# EAGLE design final-schematic_Alternate_Placement (EAGLE 8.4.0)
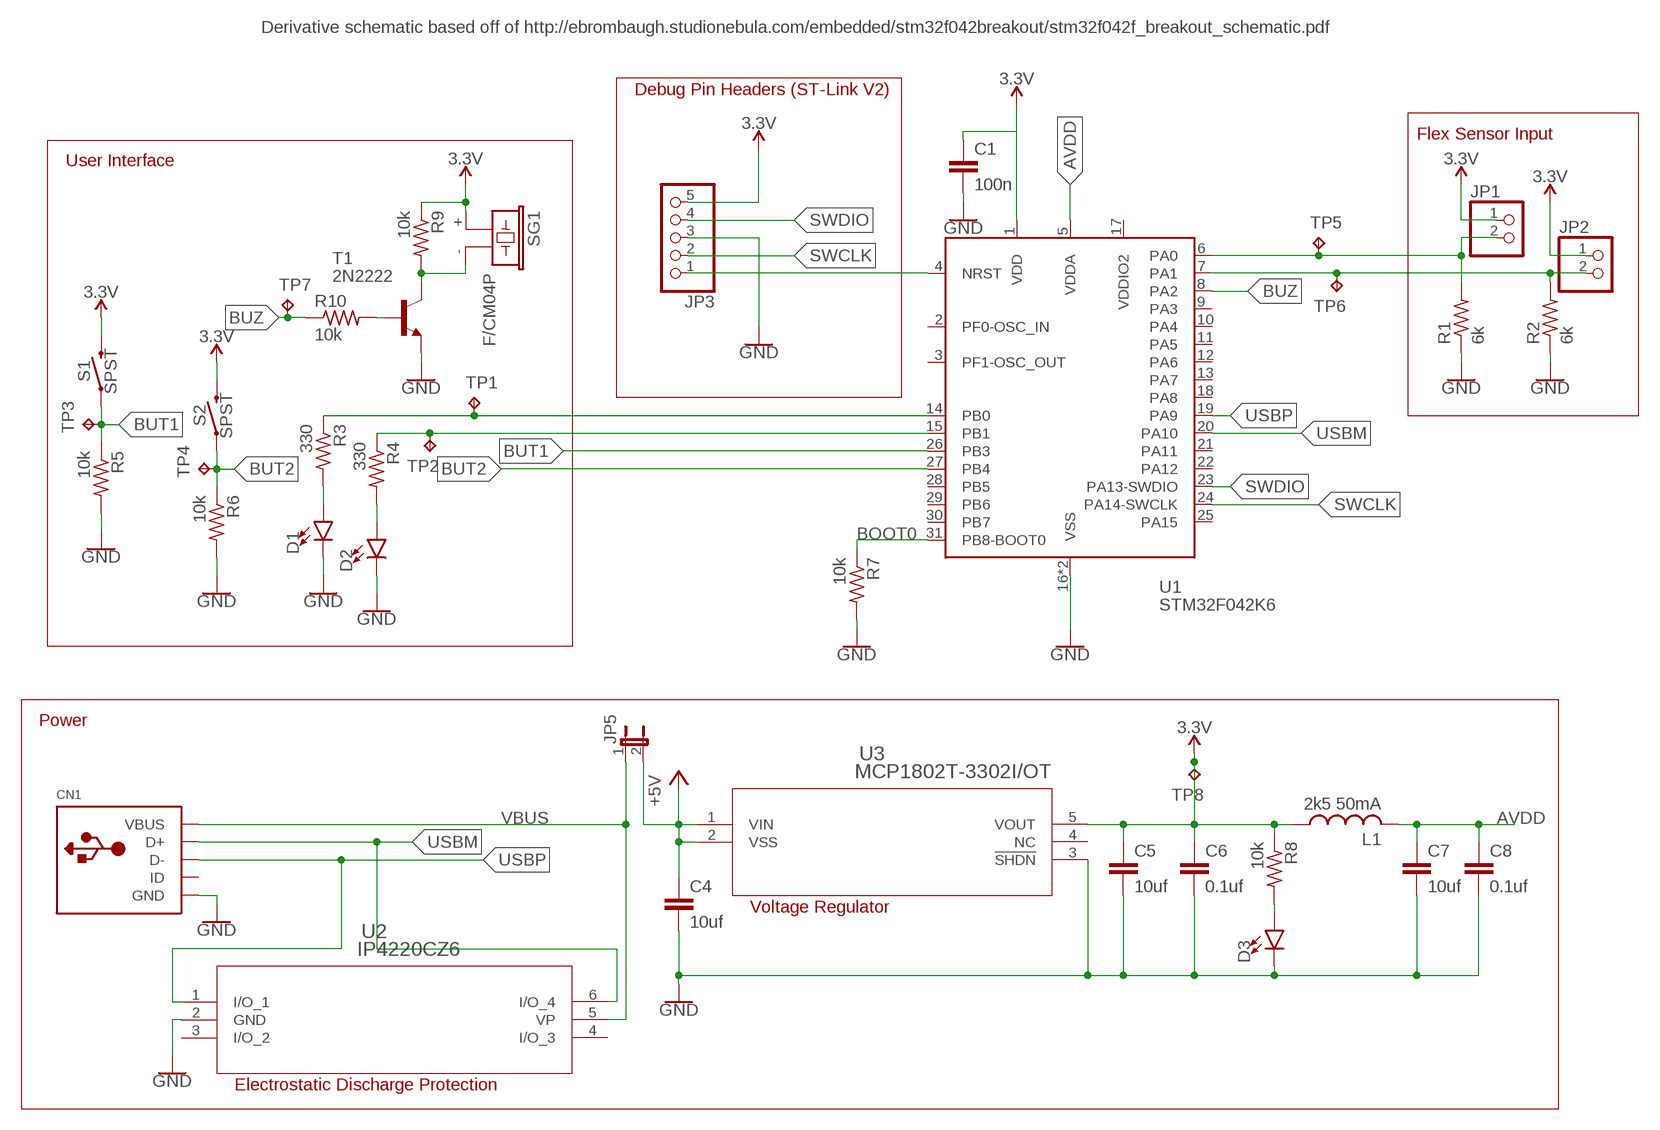
[diagram p0: schematic, sheet 1]

## Parts
C1  100n  C-EUC0805  [C0805]
C4  10uf  C-EUC0805  [C0805]
C5  10uf  C-EUC0805  [C0805]
C6  0.1uf  C-EUC0805  [C0805]
C7  10uf  C-EUC0805  [C0805]
C8  0.1uf  C-EUC0805  [C0805]
CN1  USBMOLEX  [USB-MINIB-THM-MOLEX]
D1  LED10MM  [LED_10MM]
D2  LED10MM  [LED_10MM]
D3  LED10MM  [LED_10MM]
JP1  PINHD-1X2  [1X02]
JP2  PINHD-1X2  [1X02]
JP3  PINHD-1X5  [1X05]
JP5  JP1E  [JP1]
L1  2k5 50mA  L-USL3216C  [L3216C]
R1  6k  R-US_R0805  [R0805]
R2  6k  R-US_R0805  [R0805]
R3  330  R-US_R0805  [R0805]
R4  330  R-US_R0805  [R0805]
R5  10k  R-US_R0805  [R0805]
R6  10k  R-US_R0805  [R0805]
R7  10k  R-US_R0805  [R0805]
R8  10k  R-US_R0805  [R0805]
R9  10k  R-US_R0805  [R0805]
R10  10k  R-US_R0805  [R0805]
S1  SPST  MOMENTARY-SWITCH-SPST-PTH-6.0MM  [TACTILE_SWITCH_PTH_6.0MM]
S2  SPST  MOMENTARY-SWITCH-SPST-PTH-6.0MM  [TACTILE_SWITCH_PTH_6.0MM]
SG1  F/CM04P  [F/CM04P]
T1  2N2222  [TO92-EBC-OVAL]
TP1  TPB2,54  [B2,54]
TP2  TPB2,54  [B2,54]
TP3  TPB2,54  [B2,54]
TP4  TPB2,54  [B2,54]
TP5  TPB2,54  [B2,54]
TP6  TPB2,54  [B2,54]
TP7  TPB2,54  [B2,54]
TP8  TPB2,54  [B2,54]
U1  STM32F042K6  [QFP32-7X7]
U2  IP4220CZ6  [SOT457]
U3  MCP1802T-3302I/OT  [SOT-23-5_MC]

## Nets
3.3V: C1.1 C5.1 C6.1 JP1.1 JP2.1 JP3.5 L1.1 R8.1 R9.1 S1.3 S2.3 SG1.+ TP8.TP U1.1(VDD) U3.5(VOUT)
+5V: C4.1 JP5.2 U3.1(VIN) U3.2(VSS)
AVDD: C7.1 C8.1 L1.2 U1.5(VDDA)
BOOT0: R7.1 U1.31(PB8-BOOT0)
BUT1: R5.1 S1.1 TP3.TP U1.26(PB3)
BUT2: R6.1 S2.1 TP4.TP U1.27(PB4)
BUZ: R10.1 TP7.TP U1.8(PA2)
GND: C4.2 C5.2 C6.2 C7.2 C8.2 CN1.GND D1.C D2.C D3.C JP3.3 R1.1 R2.1 R5.2 R6.2 R7.2 T1.E U1.16(VSS) U1.32(VSS) U2.2(GND) U3.3(!SHDN)
N$1: JP1.2 R1.2 TP5.TP U1.6(PA0)
N$2: JP2.2 R2.2 TP6.TP U1.7(PA1)
N$3: R3.1 TP1.TP U1.14(PB0)
N$4: R4.1 TP2.TP U1.15(PB1)
N$5: D1.A R3.2
N$6: D2.A R4.2
N$7: R9.2 SG1.- T1.C
N$8: R10.2 T1.B
N$9: D3.A R8.2
N$11: C1.2 ; supply symbol labelled GND
NRST: JP3.1 U1.4(NRST)
SWCLK: JP3.2 U1.24(PA14-SWCLK)
SWDIO: JP3.4 U1.23(PA13-SWDIO)
USBM: CN1.D+ U1.20(PA10) U2.6(I/O_4)
USBP: CN1.D- U1.19(PA9) U2.1(I/O_1)
VBUS: CN1.VBUS JP5.1 U2.5(VP)
Unconnected: CN1.ID U1.2(PF0-OSC_IN) U1.3(PF1-OSC_OUT) U1.9(PA3) U1.10(PA4) U1.11(PA5) U1.12(PA6) U1.13(PA7) U1.18(PA8) U1.21(PA11) U1.22(PA12) U1.25(PA15) U1.28(PB5) U1.29(PB6) U1.30(PB7) U2.3(I/O_2) U2.4(I/O_3) U3.4(NC)

## Notes on the sheet
- Derivative schematic based off of http://ebrombaugh.studionebula.com/embedded/stm32f042breakout/stm32f042f_breakout_schematic.pdf
- Debug Pin Headers (ST-Link V2)
- Flex Sensor Input
- User Interface
- Power
- Voltage Regulator
- Electrostatic Discharge Protection

## Power pins joined to a net without a drawn wire
VDDIO2: U1.17(VDDIO2)

## Library data of the parts
C1 C4-C8 = rcl:C-EU: CAPACITOR, European symbol
CN1 = adafruit:USB: USB Connectors USBMINIB - Surface Mount Female Mini-B USB Connector 4UConnector: 06564 By microbuilder.eu Thru-hole RA Female Mini-B USB Connector 4UConnector: 18732 By ladyada.net
D1-D3 = SparkFun-LED:LED: LED (Generic) Standard schematic elements and footprints for 5mm, 3mm, 1206, and 0603 sized LEDs. Generic LEDs with no color specified.
JP1 JP2 = pinhead:PINHD-1X2: PIN HEADER
JP3 = pinhead:PINHD-1X5: PIN HEADER
JP5 = jumper:JP1E: JUMPER
L1 = rcl:L-US: INDUCTOR, American symbol
R1-R10 = rcl:R-US_: RESISTOR, American symbol
S1 S2 = SparkFun-Switches:MOMENTARY-SWITCH-SPST: Momentary Switch (Pushbutton) - SPST Normally-open (NO) SPST momentary switches (buttons, pushbuttons). Variants PTH-12MM - 12mm square, through-hole Momentary Pushbutton Switch - 12mm Square <https://www.sparkfun.com/products/9190> (COM-09190) PTH-6.0MM, PTH-6.0MM-KIT - 6.0mm square, through-hole Mini Pushbutton Switch <https://www.sparkfun.com/products/97> (COM-00097) KIT package intended for soldering kit's - only one side of pads' copper is exposed. PTH-RIGHT-ANGLE-KIT - Right-angle, through-hole Right Angle Tactile Button <https://www.sparkfun.com/products/10791> - Used on SparkFun BigTime Watch Kit <https://www.sparkfun.com/products/11734> SMD-12MM - 12mm square, surface-mount Tactile Button - SMD (12mm) <https://www.sparkfun.com/products/12993> (COM-12993) Used on SparkFun PicoBoard <https://www.sparkfun.com/products/11888> SMD-4.5MM - 4.5mm Square Trackball Switch Used on SparkFun Blackberry Trackballer Breakout <https://www.sparkfun.com/products/13169> SMD-4.6MMX2.8MM - 4.60mm x 2.80mm, surface mount Used on SparkFun SAMD21 Mini Breakout <https://www.sparkfun.com/products/13664> SMD-5.2MM, SMD-5.2-REDUNDANT - 5.2mm square, surface-mount Mini Pushbutton Switch - SMD <https://www.sparkfun.com/products/8720> (COM-08720) Used on Arduino Pro Mini <https://www.sparkfun.com/products/11114> REDUNDANT package connects both switch circuits together SMD-6.0X3.5MM - 6.0 x 3.5mm, surface mount Momentary Reset Switch SMD <https://www.sparkfun.com/products/8229> (COM-08229) SMD-6.2MM-TALL - 6.2mm square, surface mount Tactile Button - SMD (6mm) <https://www.sparkfun.com/products/12992> Used on SparkFun Digital Sandbox <https://www.sparkfun.com/products/12651> SMD-RIGHT-ANGLE - Right-angle, surface mount Used on SparkFun Block for Intel® Edison - Arduino <https://www.sparkfun.com/products/13036>; PROD_ID: SWCH-08441; SF_SKU: COM-00097
SG1 = buzzer:F/CM04P: BUZZER Source: Buerklin; OC_FARNELL: unknown; OC_NEWARK: unknown
T1 = adafruit:2N2222: NPN TRANSISTOR Big oval pads
TP1-TP8 = testpad:TP: Test pad
U1 = STM32F042K:STM32F042K6
U2 = IP4220CZ6:IP4220CZ6; MANUFACTURER_PART_NUMBER: IP4220CZ6; VENDOR: NXP
U3 = MCP1802T:MCP1802T-3302I/OT; MANUFACTURER_PART_NUMBER: MCP1802T3302IOT; VENDOR: Microchip

## Board
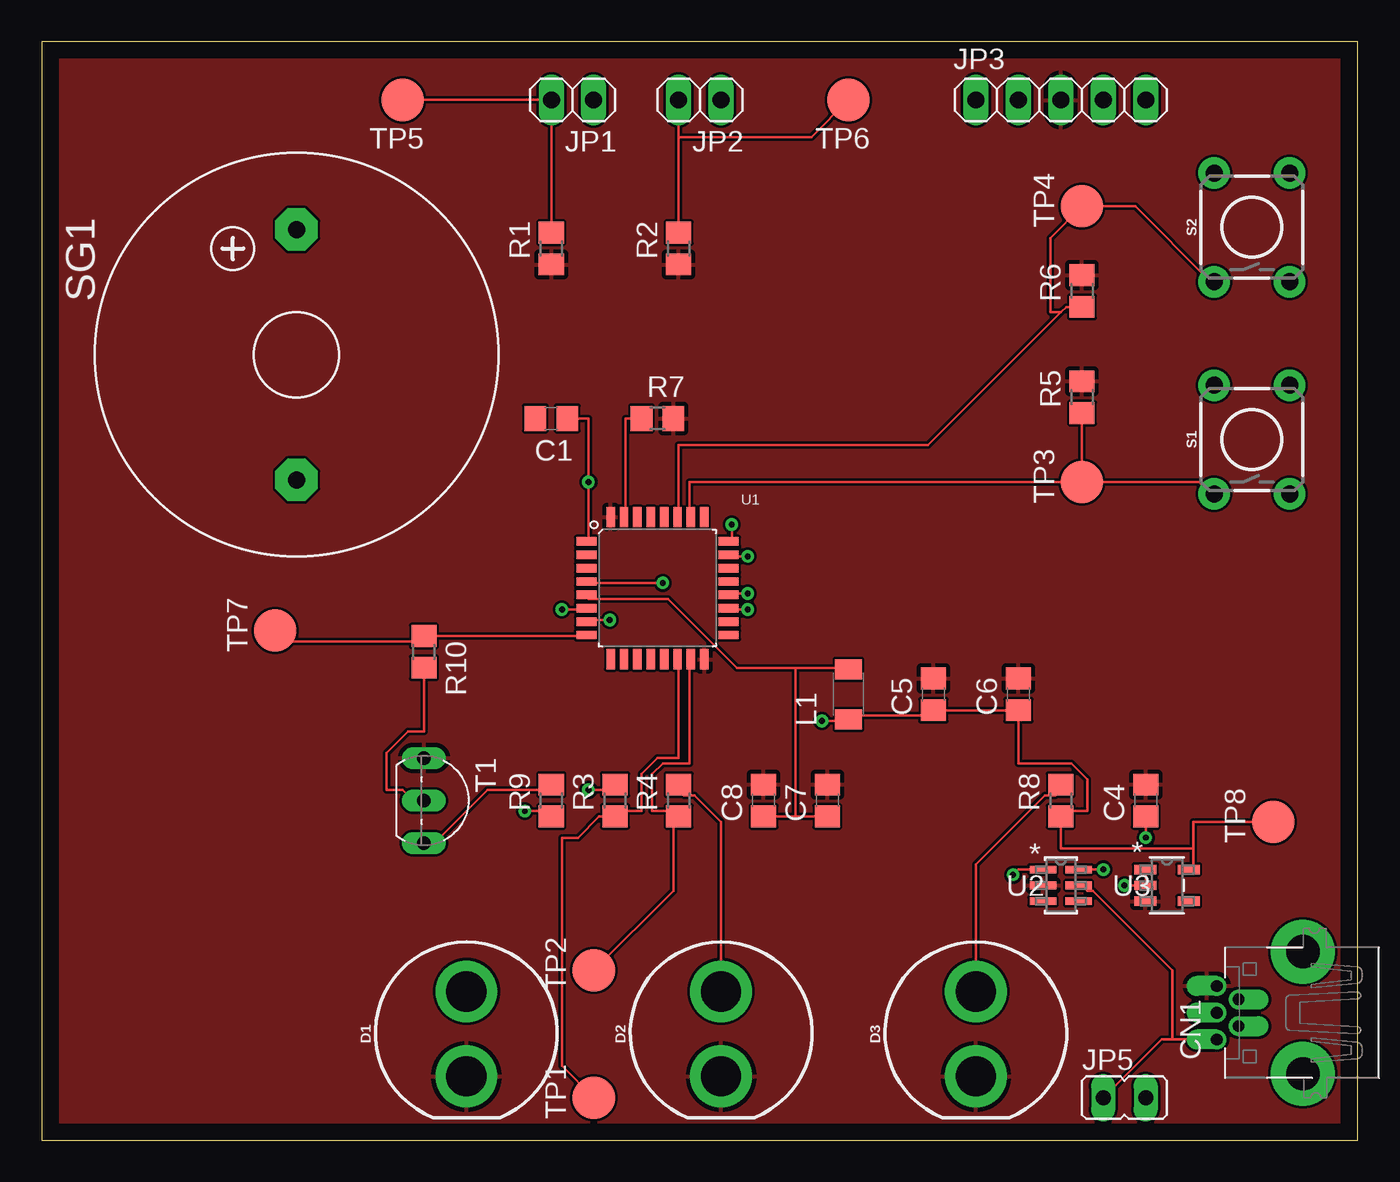
[diagram p1: board, top side]
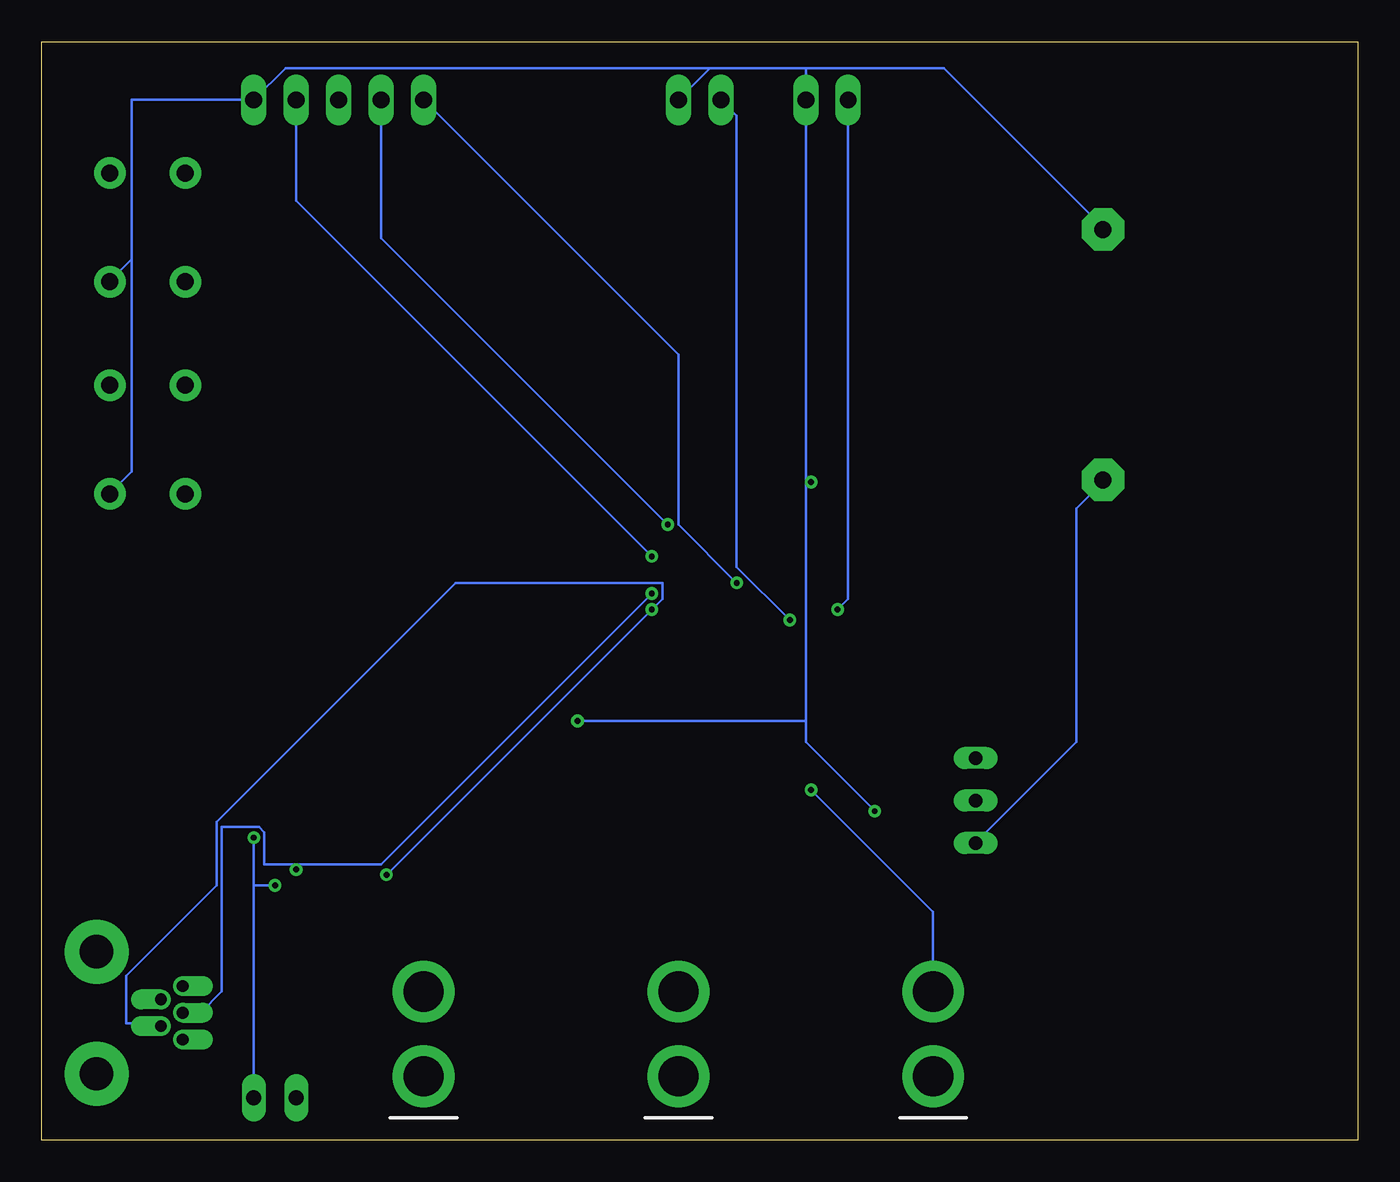
[diagram p2: board, bottom side, seen from below]

Size 78.72 x 65.71 mm. Coordinates in mm from the lower left corner, seen from the top.
Outline: 0,0 78.72,0 78.72,65.71 0,65.71 0,0
Copper layers (1*16): Top 0.035mm / dielectric 1.5mm / Bottom 0.035mm
Design rules "default": minimum track width 6mil, minimum drill 0.35mm, track to track 6mil, track to pad 6mil, pad to pad 6mil, via to via 6mil, smd to smd 6mil, copper to edge 40mil, drill to drill 6mil, minimum pad ring 10mil, minimum via ring 8mil, stop-mask expansion 4mil, vias tented up to drill 0mil, thermal gap 10mil

### Footprints (pad centres in the part's own frame; a part is rotated, then mirrored left to right if it is on the bottom)
C0805 = smd 1.3 x 1.5: 1 -0.95,0; 2 0.95,0
USB-MINIB-THM-MOLEX = drill 0.7 offset: D+ 0,9.72; D- -0.8,8.42; GND 1.6,9.72; ID 0.8,8.42; VBUS -1.6,9.72 | drill 2 pad 3.81: GND1 -3.65,4.57; GND4 3.65,4.57
LED_10MM = drill 2.4 pad 3.7: A 2.54,0; C -2.54,0
1X02 = drill 1.016 long: 1 -1.27,0; 2 1.27,0
1X05 = drill 1.016 long: 1 -5.08,0; 2 -2.54,0; 3 0,0; 4 2.54,0; 5 5.08,0
JP1 = drill 0.914 long: 1 0,-1.27; 2 0,1.27
L3216C = smd 1.2 x 1.6: 1 -1.5,0; 2 1.5,0
R0805 = smd 1.3 x 1.5: 1 -0.95,0; 2 0.95,0
TACTILE_SWITCH_PTH_6.0MM = drill 1.016 pad 1.88: 1 -3.251,2.261; 2 3.251,2.261; 3 -3.251,-2.261; 4 3.251,-2.261
F/CM04P = drill 1.016 pad 2.54 octagon: + 7.493,0; - -7.493,0
TO92-EBC-OVAL = drill 0.813 long: B 0,-1.27; C 2.54,-1.27; E -2.54,-1.27
B2,54 = smd 2.54 x 2.54: TP 0,0
QFP32-7X7 = smd 1.2 x 0.5: 1 -4.25,2.8; 2 -4.25,2; 3 -4.25,1.2; 4 -4.25,0.4; 5 -4.25,-0.4; 6 -4.25,-1.2; 7 -4.25,-2; 8 -4.25,-2.8; 17 4.25,-2.8; 18 4.25,-2; 19 4.25,-1.2; 20 4.25,-0.4; 21 4.25,0.4; 22 4.25,1.2; 23 4.25,2; 24 4.25,2.8 | smd 0.5 x 1.2: 9 -2.8,-4.25; 10 -2,-4.25; 11 -1.2,-4.25; 12 -0.4,-4.25; 13 0.4,-4.25; 14 1.2,-4.25; 15 2,-4.25; 16 2.8,-4.25; 25 2.8,4.25; 26 2,4.25; 27 1.2,4.25; 28 0.4,4.25; 29 -0.4,4.25; 30 -1.2,4.25; 31 -2,4.25; 32 -2.8,4.25
SOT457 = smd 1.575 x 0.457: 1 -1.067,0.95; 2 -1.067,0; 3 -1.067,-0.95; 4 1.067,-0.95; 5 1.067,0; 6 1.067,0.95
SOT-23-5_MC = smd 1.321 x 0.559: 1 -1.295,0.95; 2 -1.295,0; 3 -1.295,-0.95; 4 1.295,-0.95; 5 1.295,0.95

### Placement (x,y rotation side)
C1  30.48,43.18 180 top
C4  66.04,20.32 90 top
C5  53.34,26.67 90 top
C6  58.42,26.67 90 top
C7  46.99,20.32 90 top
C8  43.18,20.32 90 top
CN1  80.01,7.62 90 top
D1  25.4,6.35 90 top
D2  40.64,6.35 90 top
D3  55.88,6.35 90 top
JP1  31.75,62.23 180 top
JP2  39.37,62.23 180 top
JP3  60.96,62.23 0 top
JP5  64.77,2.54 270 top
L1  48.26,26.67 90 top
R1  30.48,53.34 90 top
R2  38.1,53.34 90 top
R3  34.29,20.32 90 top
R4  38.1,20.32 90 top
R5  62.23,44.45 90 top
R6  62.23,50.8 90 top
R7  36.83,43.18 0 top
R8  60.96,20.32 90 top
R9  30.48,20.32 90 top
R10  22.86,29.21 270 top
S1  72.39,41.91 90 top
S2  72.39,54.61 90 top
SG1  15.24,46.99 90 top
T1  24.13,20.32 270 top
TP1  33.02,2.54 90 top
TP2  33.02,10.16 90 top
TP3  62.23,39.37 90 top
TP4  62.23,55.88 90 top
TP5  21.59,62.23 180 top
TP6  48.26,62.23 180 top
TP7  13.97,30.48 90 top
TP8  73.66,19.05 90 top
U1  36.83,33.02 0 top
U2  60.96,15.24 0 top
U3  67.31,15.24 0 top

### Tracks (layer width: path | path; a pad name or v marks a point on that pad's centre or on a via)
3.3V  (via drill 0.35)
  Top 0.152: C6.1 C5.1 | C5.1 53.02,25.4 48.26,25.4 L1.1 48.26,25.08 v46.67,25.08 | C5.1 | 68.9,17.46 68.9,19.05 TP8.TP | 68.9,17.46 68.9,16.19 U3.5 | 68.9,17.46 60.96,17.46 R8.1 60.96,19.68 62.55,19.68 62.55,21.59 61.59,22.54 58.42,22.54 C6.1 | C6.1 | C1.1 32.7,43.18 v32.7,39.37 32.7,35.88 U1.1 | v28.89,19.68 30.48,19.68 R9.1
  Bottom 0.152: 73.34,52.7 73.34,62.23 JP3.5 64.14,64.14 38.73,64.14 | 73.34,52.7 74.61,51.44 S2.3 | 73.34,52.7 73.34,40.01 74.61,38.73 S1.3 | v28.89,19.68 33.02,23.81 33.02,25.08 | 33.02,39.37 JP1.1 33.02,64.14 | 33.02,39.37 33.02,25.08 | 38.73,64.14 JP2.1 | 33.02,64.14 38.73,64.14 | 33.02,39.37 v32.7,39.37 | 33.02,64.14 24.77,64.14 15.24,54.61 SG1.+ | 33.02,25.08 v46.67,25.08
+5V  (via drill 0.35)
  Top 0.152: U3.1 66.04,16.19 66.04,15.24 U3.2 v64.77,15.24 | v66.04,18.1 C4.1
  Bottom 0.152: JP5.2 66.04,15.24 | 66.04,15.24 v66.04,18.1 | 66.04,15.24 v64.77,15.24
AVDD
  Top 0.152: 45.09,19.37 C7.1 | 45.09,19.37 C8.1 | 45.09,28.26 48.26,28.26 L1.2 | 45.09,28.26 41.59,28.26 37.47,32.38 32.7,32.38 U1.5 | 45.09,28.26 45.09,19.37
BOOT0
  Top 0.152: R7.1 34.92,43.18 34.92,37.47 U1.31
BUT1
  Top 0.152: TP3.TP 38.73,39.37 38.73,37.47 U1.26 | TP3.TP R5.1 | TP3.TP 69.22,39.37 69.85,38.73 S1.1
BUT2
  Top 0.152: 60.96,49.53 61.28,49.85 R6.1 | 60.96,49.53 53.02,41.59 38.1,41.59 38.1,37.47 U1.27 | 60.96,49.53 60.33,49.53 60.33,53.98 TP4.TP 65.41,55.88 69.85,51.44 S2.1
BUZ
  Top 0.152: U1.8 32.38,30.16 R10.1 22.86,29.84 14.61,29.84 TP7.TP
GND
  pour Top: -1.27,67.31 -1.27,-1.27 80.01,-1.27 80.01,67.31
N$1  (via drill 0.35)
  Top 0.152: v31.11,31.75 32.38,31.75 U1.6 | R1.2 JP1.2 TP5.TP
  Bottom 0.152: v31.11,31.75 30.48,32.38 JP1.2
N$2  (via drill 0.35)
  Top 0.152: v33.97,31.11 32.7,31.11 U1.7 | JP2.2 38.1,60.01 | 38.1,60.01 R2.2 | TP6.TP 46.04,60.01 38.1,60.01
  Bottom 0.152: v33.97,31.11 37.15,34.29 37.15,61.28 JP2.2
N$3
  Top 0.152: U1.14 38.1,28.57 38.1,22.86 36.83,22.86 35.88,21.91 35.88,19.68 34.29,19.68 R3.1 33.34,19.37 32.07,18.1 31.11,18.1 31.11,4.45 TP1.TP
N$4
  Top 0.152: 37.78,19.68 38.1,19.68 R4.1 37.78,19.68 | 37.78,19.68 36.51,19.68 36.51,21.91 37.15,22.54 38.73,22.54 38.73,28.57 U1.15 | TP2.TP 37.78,14.92 37.78,19.68
N$5  (via drill 0.35)
  Top 0.152: v32.7,20.95 34.29,20.95 R3.2
  Bottom 0.152: v32.7,20.95 25.4,13.65 D1.A
N$6
  Top 0.152: D2.A 40.64,19.05 39.05,20.64 38.42,20.64 38.1,20.95 R4.2
N$7
  Top 0.152: T1.C 23.5,17.78 26.67,20.95 30.48,20.95 R9.2
  Bottom 0.152: T1.C 16.83,23.81 16.83,37.78 15.24,39.37 SG1.-
N$8
  Top 0.152: R10.2 22.86,24.45 21.91,24.45 20.64,23.18 20.64,20.95 21.59,20.95 22.23,20.32 T1.B
N$9
  Top 0.152: D3.A 55.88,16.51 60.01,20.64 60.64,20.64 60.96,20.95 R8.2
NRST  (via drill 0.35)
  Top 0.152: v37.15,33.34 32.7,33.34 U1.4
  Bottom 0.152: v37.15,33.34 40.64,36.83 40.64,46.99 JP3.1
SWCLK  (via drill 0.35)
  Top 0.152: v41.27,36.83 41.27,35.88 U1.24
  Bottom 0.152: v41.27,36.83 58.42,53.98 JP3.2
SWDIO  (via drill 0.35)
  Top 0.152: v42.23,34.92 41.27,34.92 U1.23
  Bottom 0.152: v42.23,34.92 63.5,56.2 JP3.4
USBM  (via drill 0.35)
  Top 0.152: v42.23,32.7 41.27,32.7 U1.20 | v63.5,16.19 62.23,16.19 U2.6
  Bottom 0.152: v42.23,32.7 58.42,16.51 63.5,16.51 | 63.5,16.51 65.41,16.51 65.41,18.41 65.72,18.73 67.94,18.73 67.94,8.89 69.22,7.62 CN1.D+ | 63.5,16.51 v63.5,16.19
USBP  (via drill 0.35)
  Top 0.152: v42.23,31.75 41.27,31.75 U1.19 | v58.1,15.88 58.42,16.19 59.69,16.19 U2.1
  Bottom 0.152: v58.1,15.88 v42.23,31.75 41.59,32.38 41.59,33.34 53.98,33.34 68.26,19.05 68.26,15.24 73.66,9.84 73.66,6.99 71.75,6.99 CN1.D-
VBUS
  Top 0.152: 67.63,6.03 67.63,10.16 62.87,14.92 62.55,14.92 62.23,15.24 U2.5 | 67.63,6.03 70.17,6.03 CN1.VBUS | JP5.1 66.99,6.03 67.63,6.03